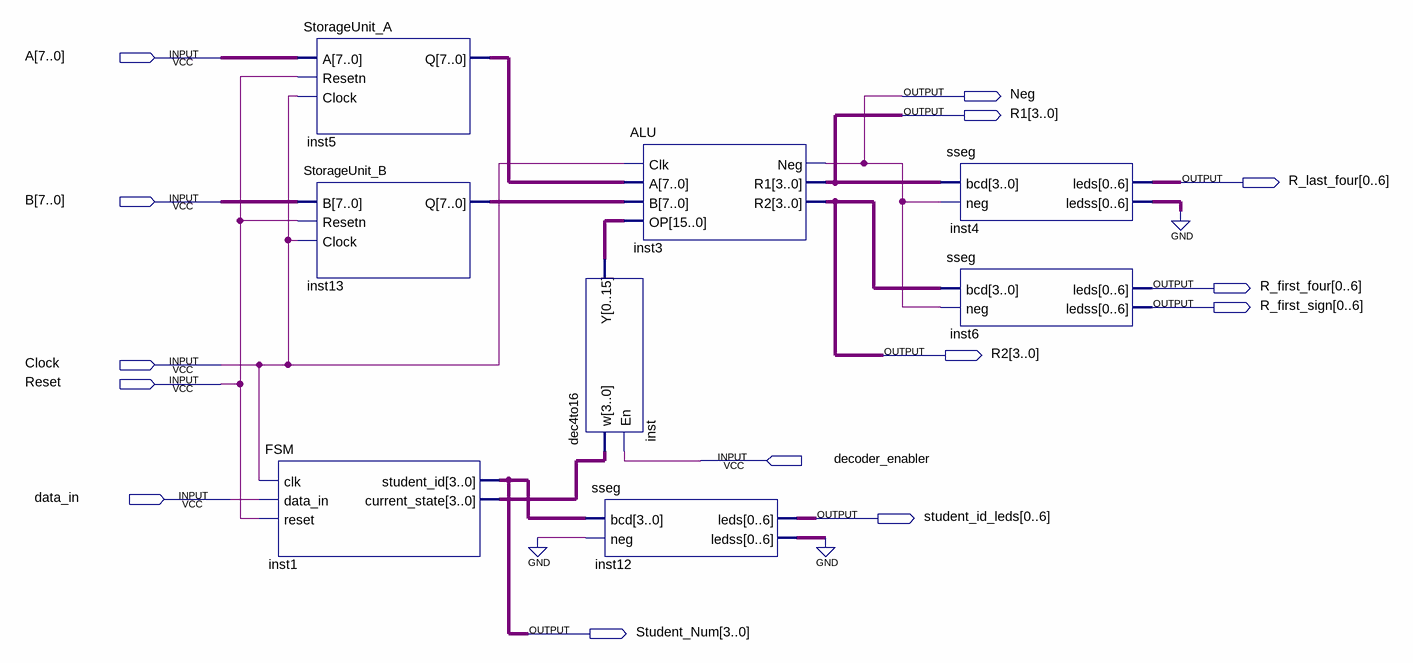
[diagram p0: schematic sheet]
// Quartus schematic Lab6_problem1.bdf as structural Verilog: 8 symbols, 14 pins
module Lab6_problem1 (
  input  [7:0] A,
  input  [7:0] B,
  input  Clock,
  input  Reset,
  input  decoder_enabler,
  input  data_in,
  output Neg,
  output [3:0] R1,
  output [0:6] R_last_four,
  output [0:6] R_first_four,
  output [0:6] R_first_sign,
  output [3:0] R2,
  output [0:6] student_id_leds,
  output [3:0] Student_Num
);

  wire [3:0] inst1_current_state;
  wire [6:0] inst4_ledss, inst12_ledss;
  wire [7:0] inst5_q, inst13_q;
  wire [15:0] inst_y;

  FSM inst1 (
    .clk(Clock), .data_in(data_in), .reset(Reset), .student_id(Student_Num),
    .current_state(inst1_current_state));
  StorageUnit_A inst5 (.A(A), .Resetn(Reset), .Clock(Clock), .Q(inst5_q));
  StorageUnit_B inst13 (.B(B), .Resetn(Reset), .Clock(Clock), .Q(inst13_q));
  dec4to16 inst (.w(inst1_current_state), .En(decoder_enabler), .Y(inst_y));
  sseg inst12 (.bcd(Student_Num), .neg(1'b0), .leds(student_id_leds), .ledss(inst12_ledss));
  ALU inst3 (.Clk(Clock), .A(inst5_q), .B(inst13_q), .OP(inst_y), .Neg(Neg), .R1(R1), .R2(R2));
  sseg inst4 (.bcd(R1), .neg(Neg), .leds(R_last_four), .ledss(inst4_ledss));
  sseg inst6 (.bcd(R2), .neg(Neg), .leds(R_first_four), .ledss(R_first_sign));
  // also tied to GND on the sheet: {inst12_ledss[0], inst12_ledss[1], inst12_ledss[2], inst12_ledss[3], inst12_ledss[4], inst12_ledss[5], inst12_ledss[6], inst4_ledss[0], inst4_ledss[1], inst4_ledss[2], inst4_ledss[3], inst4_ledss[4], inst4_ledss[5], inst4_ledss[6]}
endmodule
